# Altium schematic sheet Top.SchDoc
size A4; Organization: TESLA Motors, INC; Address1: 3500 Deer Creek Road; Address2: Palo Alto, CA; Address4: U.S.A.; SheetNumber: 1; SheetTotal: 21
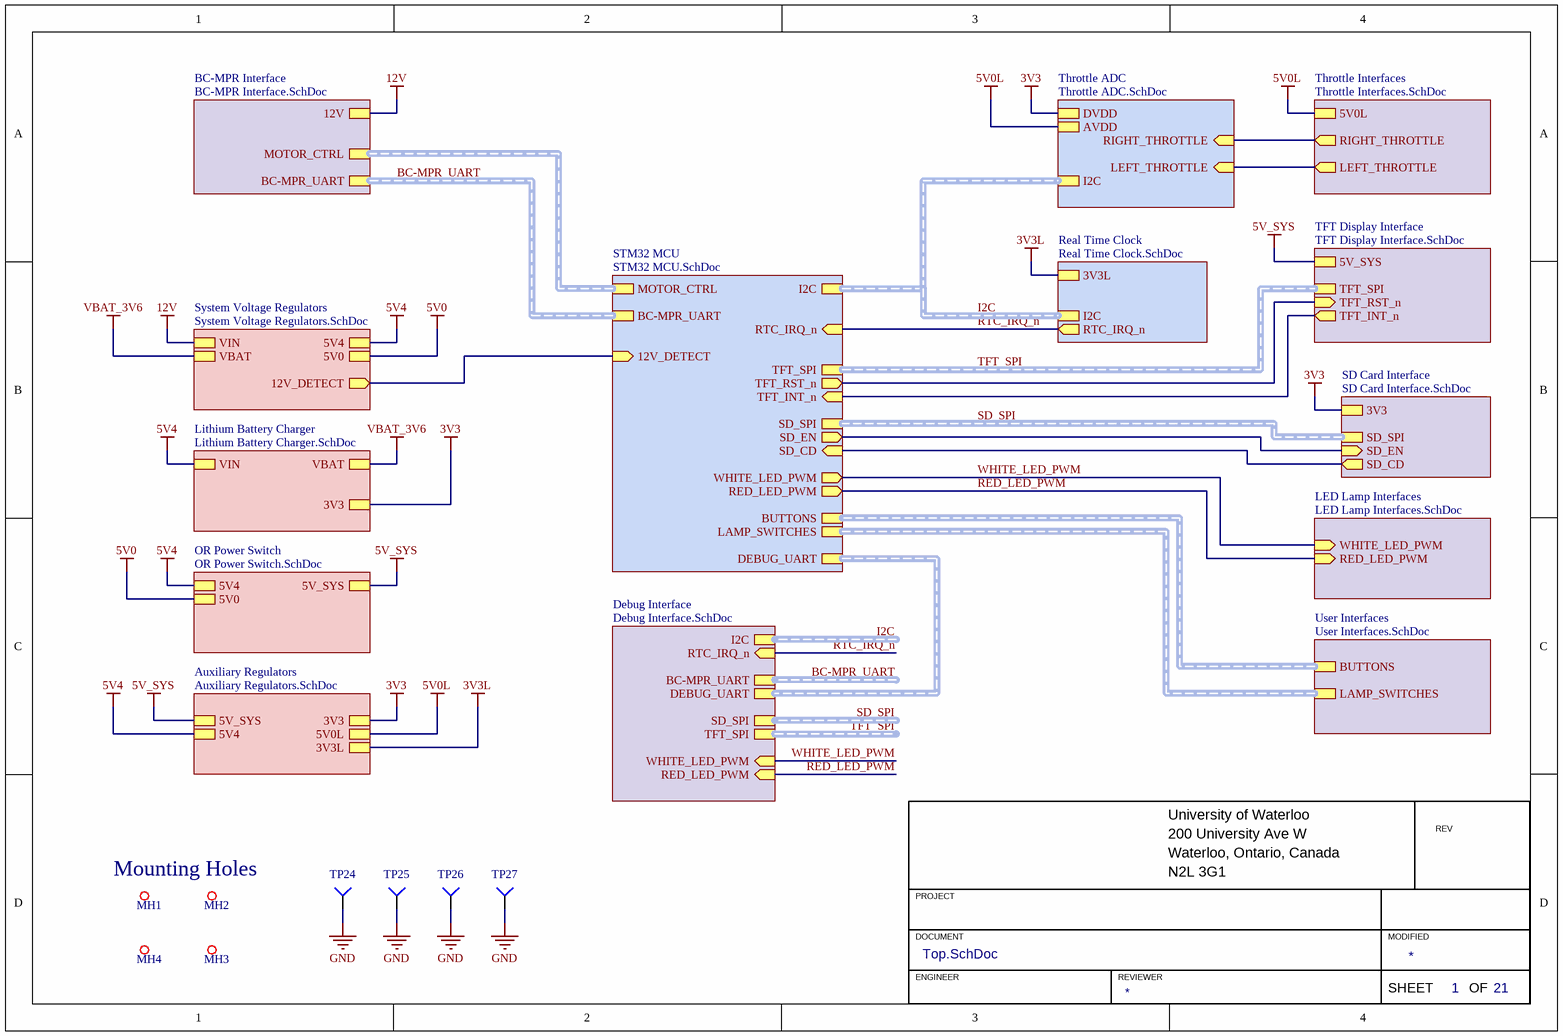
[diagram p0: Top.SchDoc]

## Parts
MH1  MOUNTING_HOLE_M3  [MOUNTING_HOLE_3mm]  (value not drawn)  (no BOM)
MH2  MOUNTING_HOLE_M3  [MOUNTING_HOLE_3mm]  (value not drawn)  (no BOM)
MH3  MOUNTING_HOLE_M3  [MOUNTING_HOLE_3mm]  (value not drawn)  (no BOM)
MH4  MOUNTING_HOLE_M3  [MOUNTING_HOLE_3mm]  (value not drawn)  (no BOM)
TP24  TESTPOINT_KEYSTONE_LOOP  [KEYSTONE_5019]  (value not drawn)
TP25  TESTPOINT_KEYSTONE_LOOP  [KEYSTONE_5019]  (value not drawn)
TP26  TESTPOINT_KEYSTONE_LOOP  [KEYSTONE_5019]  (value not drawn)
TP27  TESTPOINT_KEYSTONE_LOOP  [KEYSTONE_5019]  (value not drawn)

## Sub-sheets
Auxiliary Regulators = Auxiliary Regulators.SchDoc: 5V_SYS, 3V3, 5V0L, 5V4, 3V3L
BC-MPR Interface = BC-MPR Interface.SchDoc: BC-MPR_UART (harness UART), MOTOR_CTRL (harness MOTOR CTRL), 12V
Debug Interface = Debug Interface.SchDoc: I2C (harness I2C), RTC_IRQ_n (in), BC-MPR_UART (harness UART), DEBUG_UART (harness UART), SD_SPI (harness SPI), TFT_SPI (harness SPI), WHITE_LED_PWM (in), RED_LED_PWM (in)
LED Lamp Interfaces = LED Lamp Interfaces.SchDoc: WHITE_LED_PWM (in), RED_LED_PWM (in)
Lithium Battery Charger = Lithium Battery Charger.SchDoc: VIN, VBAT, 3V3
OR Power Switch = OR Power Switch.SchDoc: 5V4, 5V0, 5V_SYS
Real Time Clock = Real Time Clock.SchDoc: I2C (harness I2C), 3V3L, RTC_IRQ_n (out)
SD Card Interface = SD Card Interface.SchDoc: SD_SPI (harness SPI), 3V3, SD_CD (out), SD_EN (in)
STM32 MCU = STM32 MCU.SchDoc: I2C (harness I2C), BC-MPR_UART (harness UART), MOTOR_CTRL (harness MOTOR CTRL), TFT_SPI (harness SPI), RTC_IRQ_n (in), SD_SPI (harness SPI), SD_CD (in), 12V_DETECT (in), WHITE_LED_PWM (out), RED_LED_PWM (out), DEBUG_UART (harness UART), TFT_RST_n (out), SD_EN (out), BUTTONS (harness BUTTONS), LAMP_SWITCHES (harness LAMP SWITCHES), TFT_INT_n (in)
System Voltage Regulators = System Voltage Regulators.SchDoc: VIN, 5V0, 5V4, VBAT, 12V_DETECT (out)
TFT Display Interface = TFT Display Interface.SchDoc: TFT_SPI (harness SPI), 5V_SYS, TFT_RST_n (in), TFT_INT_n (out)
Throttle ADC = Throttle ADC.SchDoc: I2C (harness I2C), DVDD, AVDD, RIGHT_THROTTLE (in), LEFT_THROTTLE (in)
Throttle Interfaces = Throttle Interfaces.SchDoc: RIGHT_THROTTLE (out), LEFT_THROTTLE (out), 5V0L
User Interfaces = User Interfaces.SchDoc: BUTTONS (harness BUTTONS), LAMP_SWITCHES (harness LAMP SWITCHES)

## Nets
3V3: sheet Lithium Battery Charger/3V3, sheet Auxiliary Regulators/3V3, sheet Throttle ADC/DVDD, sheet SD Card Interface/3V3
3V3L: sheet Auxiliary Regulators/3V3L, sheet Real Time Clock/3V3L
5V0: sheet System Voltage Regulators/5V0, sheet OR Power Switch/5V0
5V0L: sheet Auxiliary Regulators/5V0L, sheet Throttle ADC/AVDD, sheet Throttle Interfaces/5V0L
5V4: sheet System Voltage Regulators/5V4, sheet Lithium Battery Charger/VIN, sheet OR Power Switch/5V4, sheet Auxiliary Regulators/5V4
5V_SYS: sheet TFT Display Interface/5V_SYS, sheet OR Power Switch/5V_SYS, sheet Auxiliary Regulators/5V_SYS
12V: sheet System Voltage Regulators/VIN, sheet BC-MPR Interface/12V
GND: TP24.1(=value) TP25.1(=value) TP26.1(=value) TP27.1(=value)
VBAT_3V6: sheet System Voltage Regulators/VBAT, sheet Lithium Battery Charger/VBAT
RED_LED_PWM: sheet STM32 MCU/RED_LED_PWM, sheet LED Lamp Interfaces/RED_LED_PWM, sheet Debug Interface/RED_LED_PWM
RTC_IRQ_n: sheet STM32 MCU/RTC_IRQ_n, sheet Real Time Clock/RTC_IRQ_n, sheet Debug Interface/RTC_IRQ_n
WHITE_LED_PWM: sheet STM32 MCU/WHITE_LED_PWM, sheet LED Lamp Interfaces/WHITE_LED_PWM, sheet Debug Interface/WHITE_LED_PWM
(unnamed): sheet STM32 MCU/SD_CD, sheet SD Card Interface/SD_CD
(unnamed): sheet STM32 MCU/12V_DETECT, sheet System Voltage Regulators/12V_DETECT
(unnamed): sheet STM32 MCU/TFT_RST_n, sheet TFT Display Interface/TFT_RST_n
(unnamed): sheet STM32 MCU/SD_EN, sheet SD Card Interface/SD_EN
(unnamed): sheet STM32 MCU/TFT_INT_n, sheet TFT Display Interface/TFT_INT_n
(unnamed): sheet Throttle ADC/RIGHT_THROTTLE, sheet Throttle Interfaces/RIGHT_THROTTLE
(unnamed): sheet Throttle ADC/LEFT_THROTTLE, sheet Throttle Interfaces/LEFT_THROTTLE

## Buses and harness runs
harness BC-MPR_UART = sheet BC-MPR Interface/BC-MPR_UART = sheet STM32 MCU/BC-MPR_UART
harness BC-MPR_UART = sheet Debug Interface/BC-MPR_UART
harness I2C = sheet Debug Interface/I2C
harness I2C = sheet Real Time Clock/I2C = sheet STM32 MCU/I2C = sheet Throttle ADC/I2C
harness SD_SPI = sheet Debug Interface/SD_SPI
harness SD_SPI = sheet SD Card Interface/SD_SPI = sheet STM32 MCU/SD_SPI
harness sheet BC-MPR Interface/MOTOR_CTRL = sheet STM32 MCU/MOTOR_CTRL
harness sheet Debug Interface/DEBUG_UART = sheet STM32 MCU/DEBUG_UART
harness sheet STM32 MCU/BUTTONS = sheet User Interfaces/BUTTONS
harness sheet STM32 MCU/LAMP_SWITCHES = sheet User Interfaces/LAMP_SWITCHES
harness TFT_SPI = sheet Debug Interface/TFT_SPI
harness TFT_SPI = sheet STM32 MCU/TFT_SPI = sheet TFT Display Interface/TFT_SPI

## Notes on the sheet
- University of Waterloo
- 200 University Ave W
- REV
- Mounting Holes
- PROJECT
- Waterloo, Ontario, Canada
- N2L 3G1
- DOCUMENT
- ENGINEER
- REVIEWER
- MODIFIED
- SHEET
- OF

## Library data of the parts
TP24-TP27 = TESTPOINT_KEYSTONE_LOOP: PC TEST POINT MINIATURE; Manufacturer 1: Keystone Electronics; Manufacturer Part Number 1: 5019; Package/Footprint: SMD; Supplier 1: Digi-Key; Mounting Type: SMD; Supplier Part Number 1: 36-5019CT-ND